# EAGLE design MYC_Homematic (EAGLE 7.3.0)
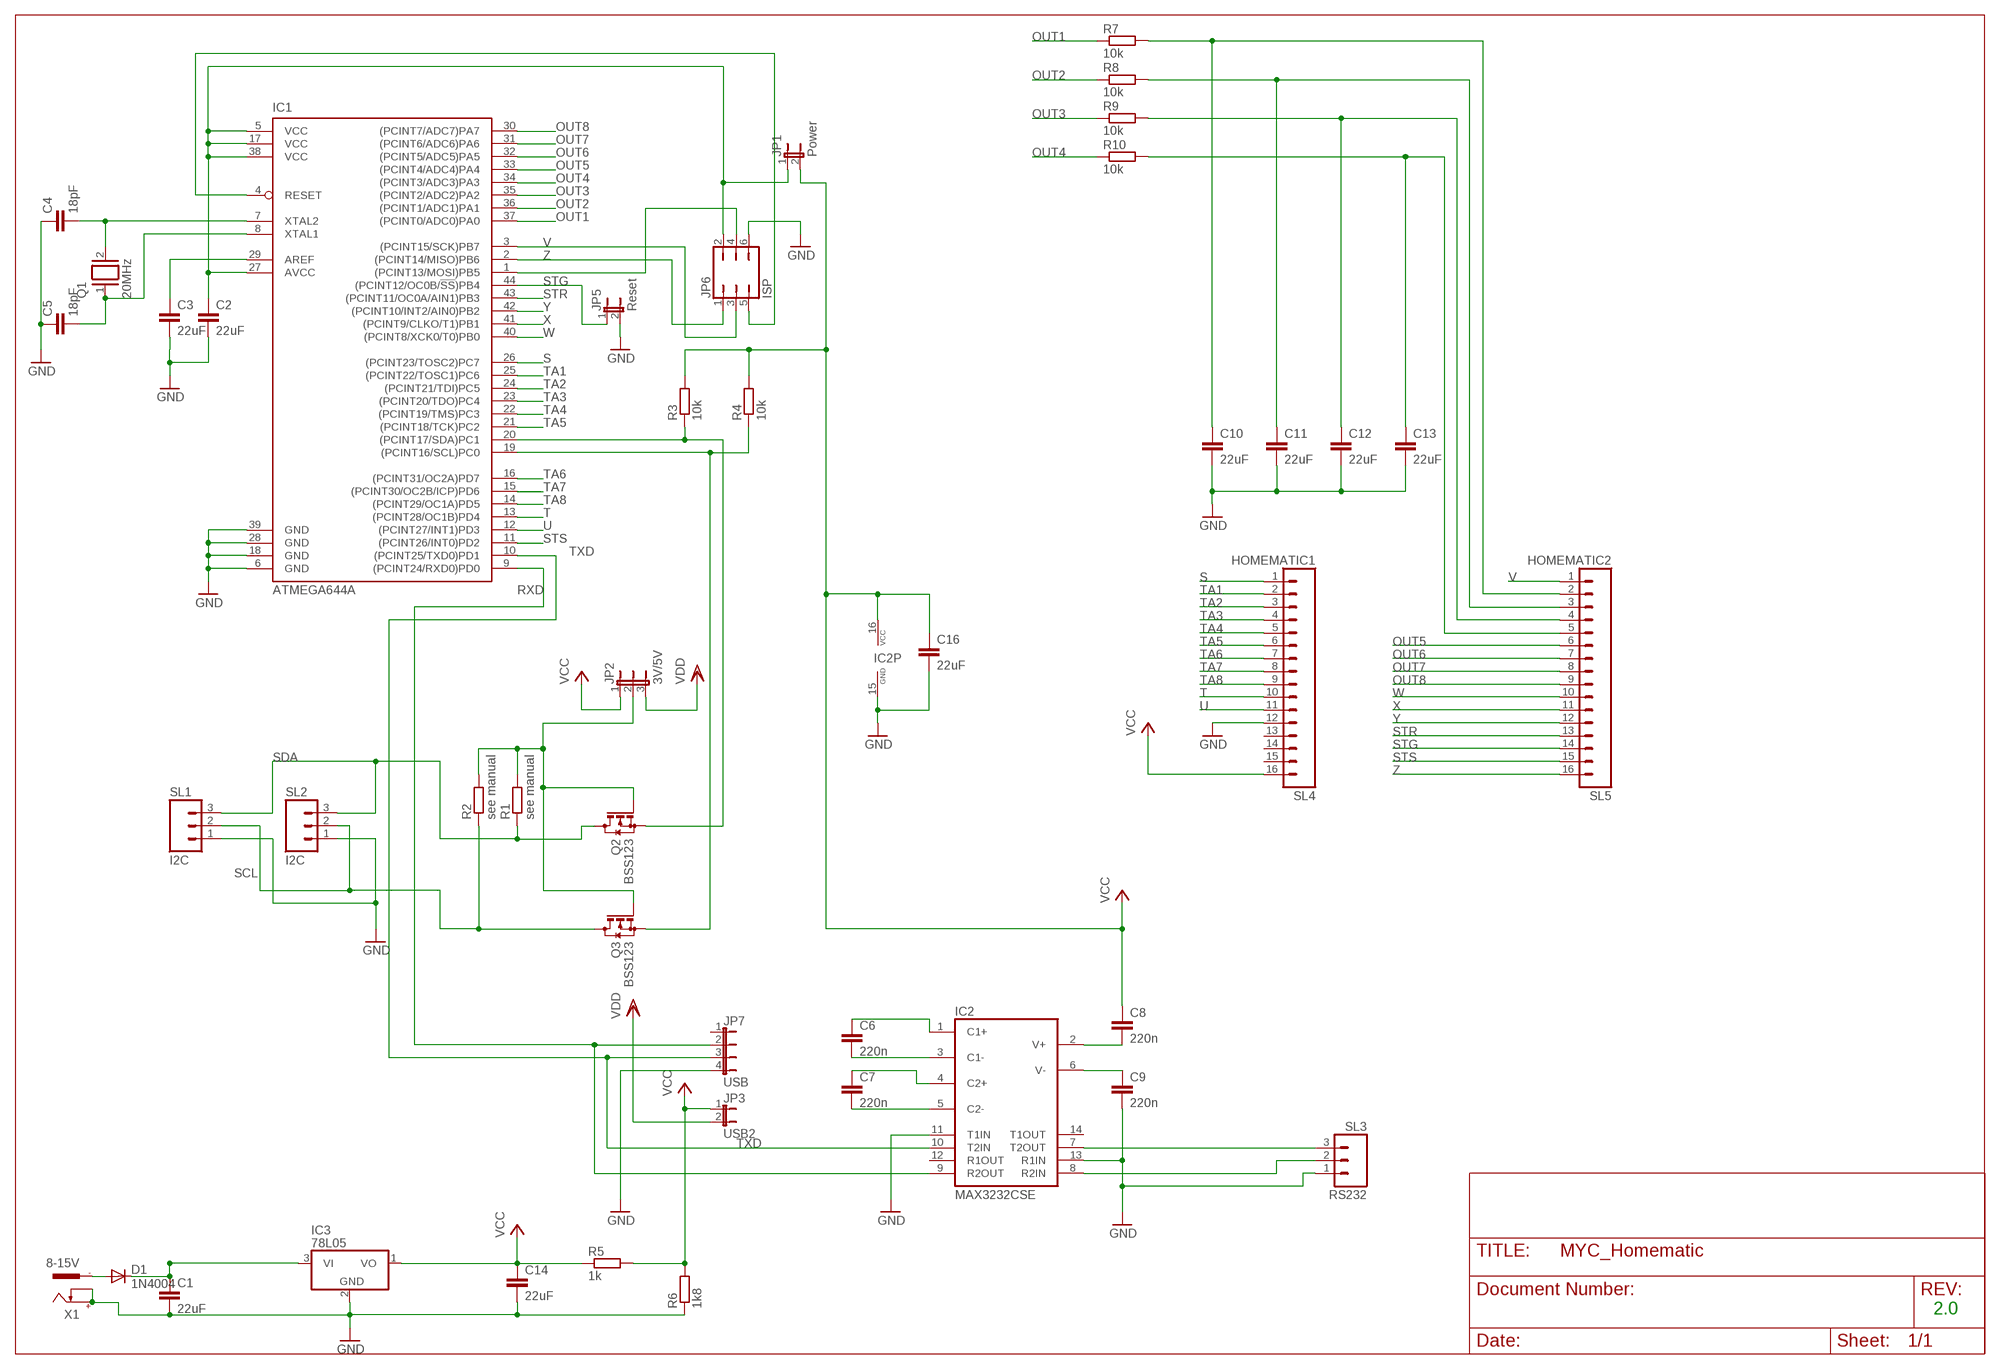
[diagram p0: schematic, sheet 1]

## Parts
C1  22uF  C-EUC1206  [C1206]
C2  22uF  C-EUC1206  [C1206]
C3  22uF  C-EUC1206  [C1206]
C4  18pF  C-EU025-030X050  [C025-030X050]
C5  18pF  C-EU025-030X050  [C025-030X050]
C6  220n  C-EUC1206  [C1206]
C7  220n  C-EUC1206  [C1206]
C8  220n  C-EUC1206  [C1206]
C9  220n  C-EUC1206  [C1206]
C10  22uF  C-EUC1206  [C1206]
C11  22uF  C-EUC1206  [C1206]
C12  22uF  C-EUC1206  [C1206]
C13  22uF  C-EUC1206  [C1206]
C14  22uF  C-EUC1206  [C1206]
C16  22uF  C-EUC1206  [C1206]
D1  1N4004  [DO41-10]
IC1  ATMEGA644A  [TQFP44]
IC2  MAX3232CSE  [SO16]
IC3  78L05  7805L  [TO92]
JP1  Power  JP1E  [JP1]
JP2  3V/5V  JP2E  [JP2]
JP3  USB2  JP1E  [JP1]
JP5  Reset  JP1E  [JP1]
JP6  ISP  JP3Q  [JP3Q]
JP7  USB  JP4E  [JP4]
Q1  20MHz  XTAL/S  [QS]
Q2  BSS123  [SOT23]
Q3  BSS123  [SOT23]
R1  see manual  R-EU_R1206  [R1206]
R2  see manual  R-EU_R1206  [R1206]
R3  10k  R-EU_R1206  [R1206]
R4  10k  R-EU_R1206  [R1206]
R5  1k  R-EU_R1206  [R1206]
R6  1k8  R-EU_R1206  [R1206]
R7  10k  R-EU_R1206  [R1206]
R8  10k  R-EU_R1206  [R1206]
R9  10k  R-EU_R1206  [R1206]
R10  10k  R-EU_R1206  [R1206]
SL1  I2C  M03  [03P]
SL2  I2C  M03  [03P]
SL3  RS232  M03  [03P]
SL4  HOMEMATIC1  M16  [16P]
SL5  HOMEMATIC2  M16  [16P]
X1  8-15V  737992-55  [737992-5]

## Nets
C13: C6.1 IC2.1(C1+)
GND: C1.2 C2.2 C3.2 C4.1 C5.1 C9.2 C10.2 C11.2 C12.2 C13.2 C14.2 C16.2 IC1.6(GND) IC1.18(GND) IC1.28(GND) IC1.39(GND) IC2.11(T1IN) IC2.13(R1IN) IC2.15(GND) IC3.2(GND) JP5.2 JP6.6 JP7.4 R6.1 SL1.1 SL2.1 SL3.1 SL4.12 X1.+ X1.K
N$1: C1.1 D1.C IC3.3(VI)
N$3: C7.2 IC2.5(C2-)
N$4: JP2.2 Q2.1(G) Q3.1(G) R1.2 R2.2
N$5: IC1.19((PCINT16/SCL)PC0) Q3.2(S) R4.1
N$6: C3.1 IC1.29(AREF)
N$7: C2.1 IC1.5(VCC) IC1.17(VCC) IC1.27(AVCC) IC1.38(VCC) JP1.1 JP6.2
N$8: IC1.20((PCINT17/SDA)PC1) Q2.2(S) R3.1
N$10: D1.A X1.-1
N$11: IC2.8(R2IN) SL3.2
N$12: IC1.1((PCINT13/MOSI)PB5) JP6.4
N$13: C7.1 IC2.4(C2+)
N$14: C6.2 IC2.3(C1-)
N$15: C10.1 R7.2 SL5.2
N$16: C8.2 IC2.2(V+)
N$17: C9.1 IC2.6(V-)
N$19: C4.2 IC1.7(XTAL2) Q1.2
N$20: C11.1 R8.2 SL5.3
N$21: C12.1 R9.2 SL5.4
N$22: C13.1 R10.2 SL5.5
N$24: IC1.4(RESET) JP6.5
N$27: IC2.7(T2OUT) SL3.3
N$37: C5.2 IC1.8(XTAL1) Q1.1
OUT1: IC1.37((PCINT0/ADC0)PA0) R7.1
OUT2: IC1.36((PCINT1/ADC1)PA1) R8.1
OUT3: IC1.35((PCINT2/ADC2)PA2) R9.1
OUT4: IC1.34((PCINT3/ADC3)PA3) R10.1
OUT5: IC1.33((PCINT4/ADC4)PA4) SL5.6
OUT6: IC1.32((PCINT5/ADC5)PA5) SL5.7
OUT7: IC1.31((PCINT6/ADC6)PA6) SL5.8
OUT8: IC1.30((PCINT7/ADC7)PA7) SL5.9
RXD: IC1.9((PCINT24/RXD0)PD0) IC2.9(R2OUT) JP7.2
S: IC1.26((PCINT23/TOSC2)PC7) SL4.1
SCL: Q3.3(D) R2.1 SL1.2 SL2.2
SDA: Q2.3(D) R1.1 SL1.3 SL2.3
STG: IC1.44((PCINT12/OC0B/!SS!)PB4) JP5.1 SL5.14
STR: IC1.43((PCINT11/OC0A/AIN1)PB3) SL5.13
STS: IC1.11((PCINT26/INT0)PD2) SL5.15
T: IC1.13((PCINT28/OC1B)PD4) SL4.10
TA1: IC1.25((PCINT22/TOSC1)PC6) SL4.2
TA2: IC1.24((PCINT21/TDI)PC5) SL4.3
TA3: IC1.23((PCINT20/TDO)PC4) SL4.4
TA4: IC1.22((PCINT19/TMS)PC3) SL4.5
TA5: IC1.21((PCINT18/TCK)PC2) SL4.6
TA6: IC1.16((PCINT31/OC2A)PD7) SL4.7
TA7: IC1.15((PCINT30/OC2B/ICP)PD6) SL4.8
TA8: IC1.14((PCINT29/OC1A)PD5) SL4.9
TXD: IC1.10((PCINT25/TXD0)PD1) IC2.10(T2IN) JP7.3
U: IC1.12((PCINT27/INT1)PD3) SL4.11
V: IC1.3((PCINT15/SCK)PB7) JP6.3 SL5.1
VCC: C8.1 C14.1 C16.1 IC2.16(VCC) IC3.1(VO) JP1.2 JP2.1 JP3.1 R3.2 R4.2 R5.1 R5.2 R6.2 SL4.16
VDD: JP2.3 JP3.2
W: IC1.40((PCINT8/XCK0/T0)PB0) SL5.10
X: IC1.41((PCINT9/CLKO/T1)PB1) SL5.11
Y: IC1.42((PCINT10/INT2/AIN0)PB2) SL5.12
Z: IC1.2((PCINT14/MISO)PB6) JP6.1 SL5.16
Unconnected: IC2.12(R1OUT) IC2.14(T1OUT) JP7.1 SL4.13 SL4.14 SL4.15 X1.-2

## Notes on the sheet
- 2.0

## Library data of the parts
C1-C14 C16 = resistor:C-EU: CAPACITOR, European symbol
D1 = diode:1N4004: DIODE general purpose rectifier, 1 A
IC1 = atmel:ATMEGA644: 8-bit Microcontroller with 64K Bytes In-System Programmable Flash Source: http://www.atmel.com/dyn/resources/prod_documents/doc2593.pdf; MPN: ATMEGA644PV-10AU; OC_FARNELL: 1455123; OC_NEWARK: 58M3748
IC2 = maxim:MAX3232*: True RS-232 Transceivers 3.0V to 5.5V, Low-Power up to 1Mbps, Using Four 0.1µF External Capacitors Source: http://pdfserv.maxim-ic.com/en/ds/MAX3222-MAX3241.pdf; MPN: MAX3232CSE; OC_FARNELL: 9725490; OC_NEWARK: 90C2890
IC3 = linear:78*: Positive VOLTAGE REGULATOR Source: http://cache.national.com/ds/LM/LM78L05.pdf http://www.fairchildsemi.com/ds/LM/LM7805.pdf
JP1 JP3 JP5 = jumper:JP1E: JUMPER
JP2 = jumper:JP2E: JUMPER
JP6 = jumper:JP3Q: JUMPER
JP7 = jumper:JP4E: JUMPER
Q1 = special:XTAL/S: CRYSTAL
Q2 Q3 = transistor-small-signal:BSS123: N-CHANNEL MOS FET
R1-R10 = resistor:R-EU_: RESISTOR, European symbol
SL1-SL3 = con-amp-quick:M03: AMP QUICK CONNECTOR; OC_FARNELL: unknown; OC_NEWARK: unknown
SL4 SL5 = con-amp-quick:M16: AMP QUICK CONNECTOR; OC_FARNELL: unknown; OC_NEWARK: unknown
X1 = con-conrad:737992-55: FEMALE PRINT CONNECTOR DIN 45323 (34V/3A), ROKA, distributor Conrad

## Board
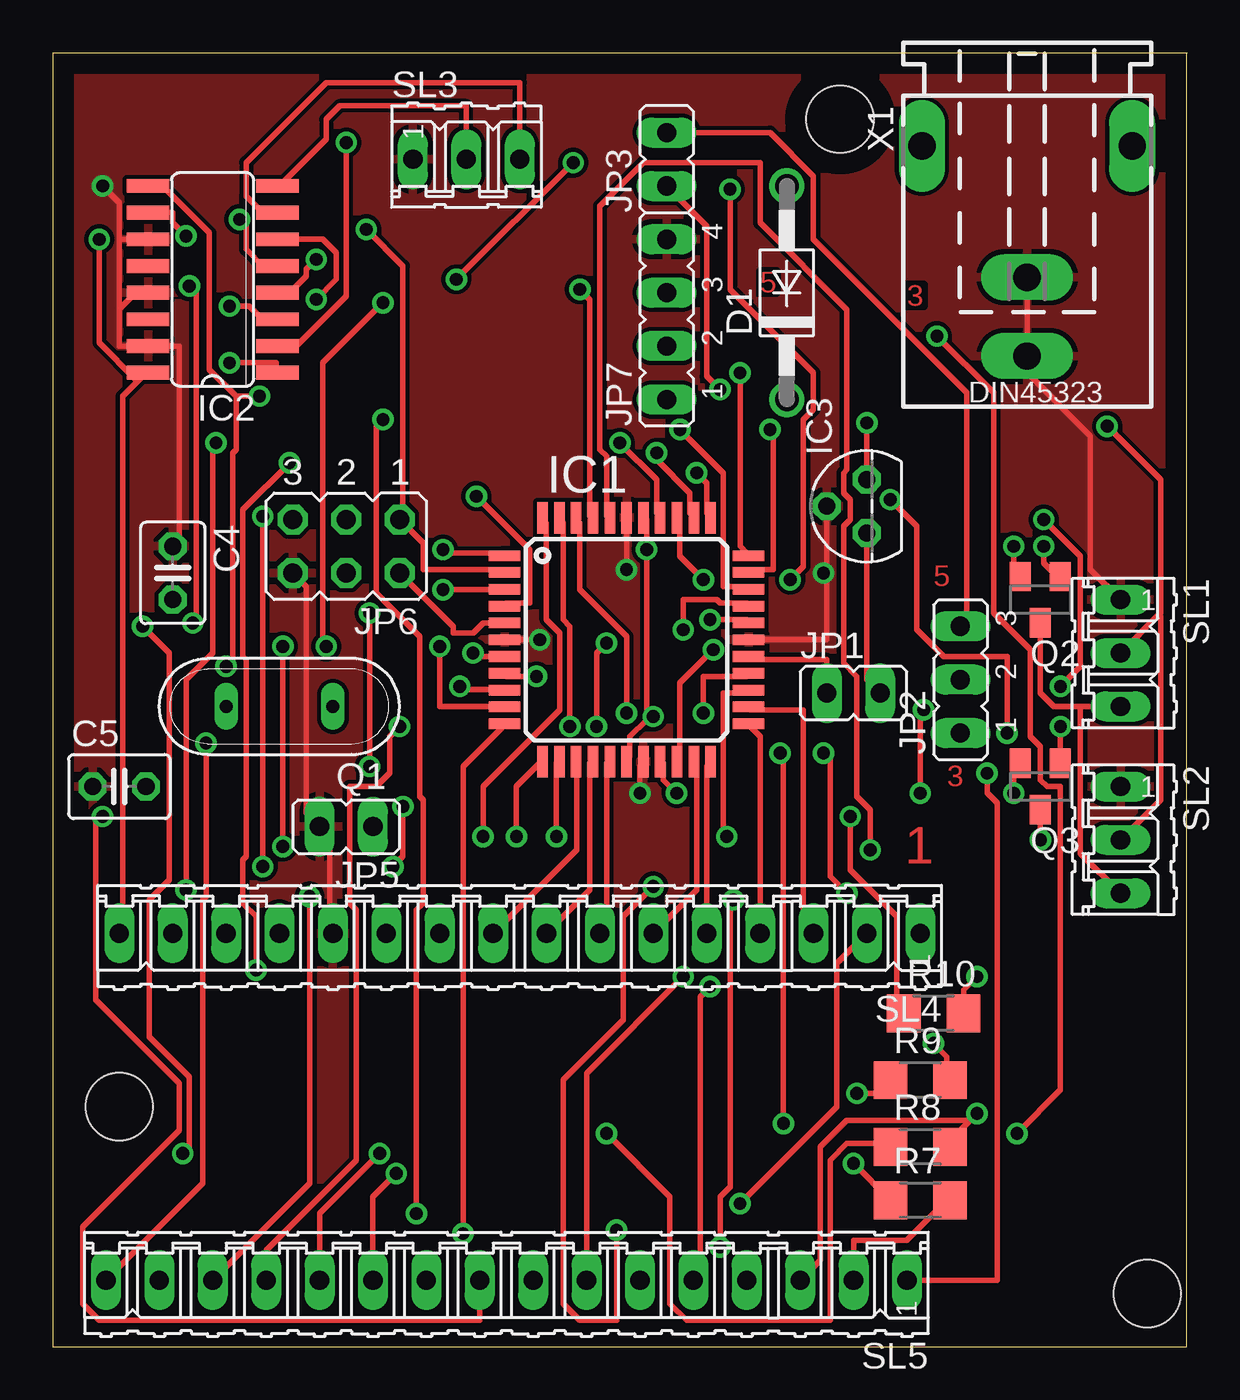
[diagram p1: board, top side]
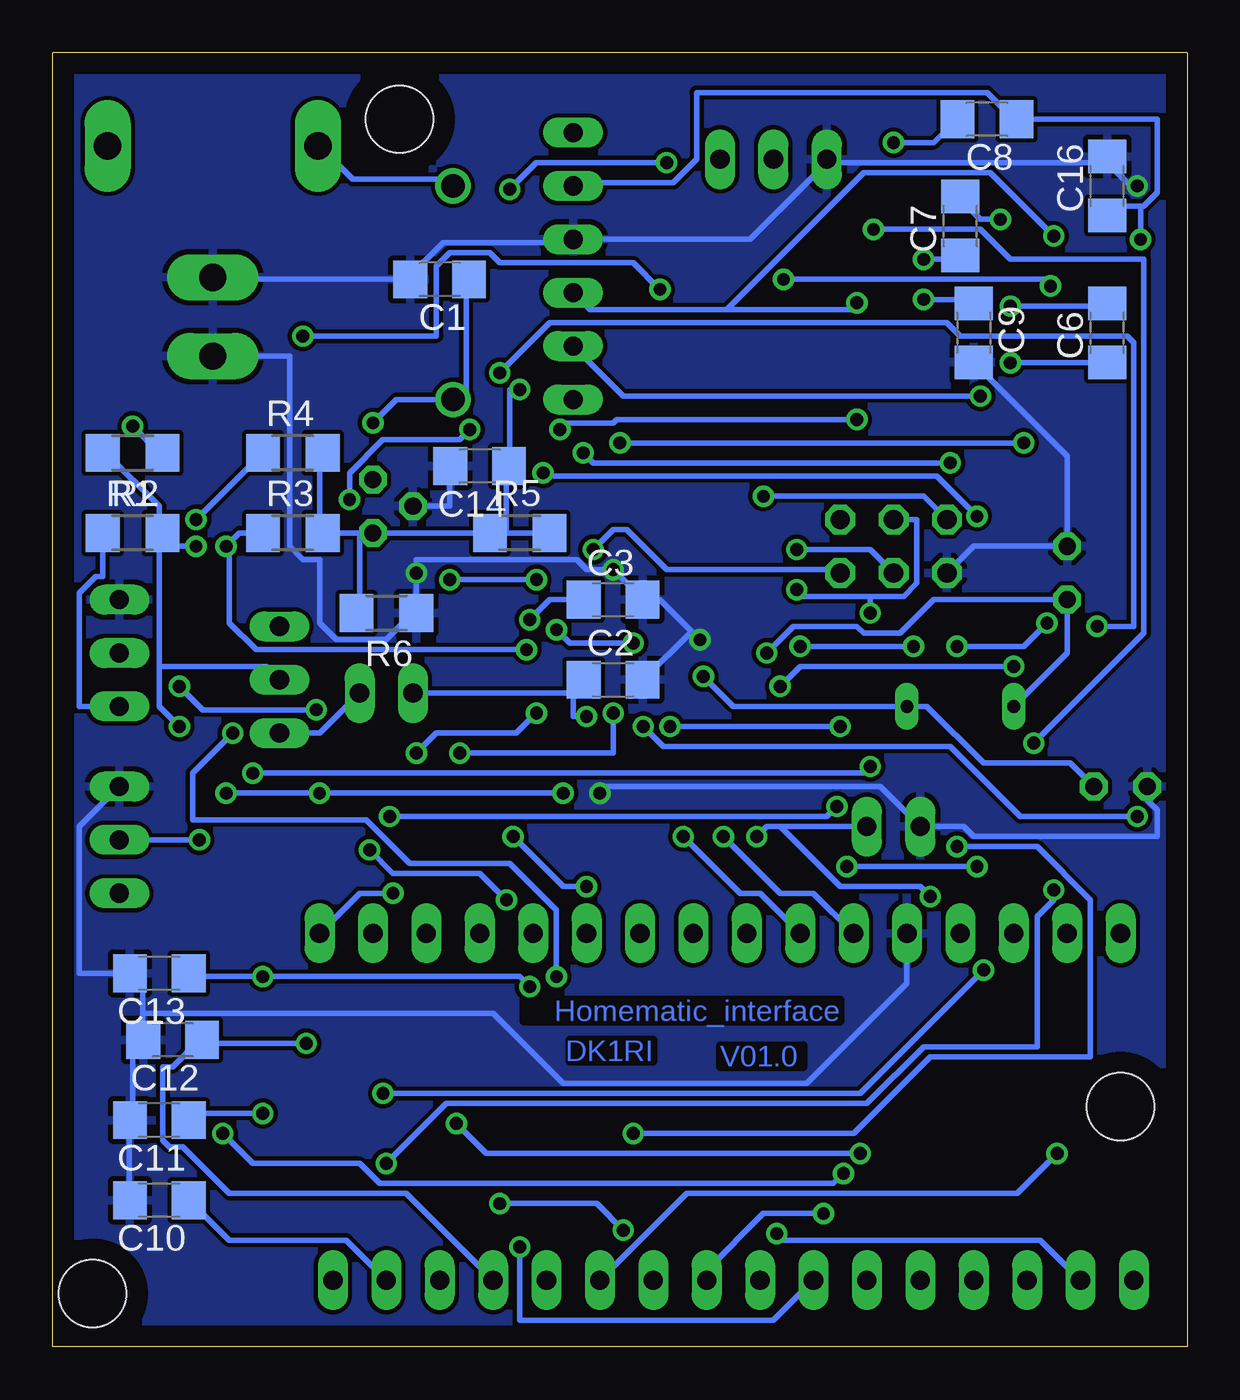
[diagram p2: board, bottom side, seen from below]

Size 53.98 x 61.59 mm. Coordinates in mm from the lower left corner, seen from the top.
Outline: 53.95,61.58 53.95,0 0,0 0,61.59 53.98,61.59
Copper layers (1*16): Top 0.035mm / dielectric 1.5mm / Bottom 0.035mm
Design rules "default": minimum track width 10mil, minimum drill 24mil, track to track 8mil, track to pad 8mil, pad to pad 8mil, via to via 8mil, smd to smd 8mil, copper to edge 40mil, drill to drill 8mil, minimum pad ring 10mil, minimum via ring 8mil, stop-mask expansion 4mil, vias tented up to drill 0mil, thermal gap 10mil
Holes 3.2 mm at 37.47,58.42 52.07,2.54 3.17,11.43

### Footprints (pad centres in the part's own frame; a part is rotated, then mirrored left to right if it is on the bottom)
C1206 = smd 1.6 x 1.8: 1 -1.4,0; 2 1.4,0
C025-030X050 = drill 0.813 octagon: 1 -1.27,0; 2 1.27,0
DO41-10 = drill 1.118: A 5.08,0; C -5.08,0
TQFP44 = smd 1.5 x 0.5: 1 -5.8,4; 2 -5.8,3.2; 3 -5.8,2.4; 4 -5.8,1.6; 5 -5.8,0.8; 6 -5.8,0; 7 -5.8,-0.8; 8 -5.8,-1.6; 9 -5.8,-2.4; 10 -5.8,-3.2; 11 -5.8,-4; 23 5.8,-4; 24 5.8,-3.2; 25 5.8,-2.4; 26 5.8,-1.6; 27 5.8,-0.8; 28 5.8,0; 29 5.8,0.8; 30 5.8,1.6; 31 5.8,2.4; 32 5.8,3.2; 33 5.8,4 | smd 0.5 x 1.5: 12 -4,-5.8; 13 -3.2,-5.8; 14 -2.4,-5.8; 15 -1.6,-5.8; 16 -0.8,-5.8; 17 0,-5.8; 18 0.8,-5.8; 19 1.6,-5.8; 20 2.4,-5.8; 21 3.2,-5.8; 22 4,-5.8; 34 4,5.8; 35 3.2,5.8; 36 2.4,5.8; 37 1.6,5.8; 38 0.8,5.8; 39 0,5.8; 40 -0.8,5.8; 41 -1.6,5.8; 42 -2.4,5.8; 43 -3.2,5.8; 44 -4,5.8
SO16 = smd 0.66 x 2.032: 1 -4.445,-3.073; 2 -3.175,-3.073; 3 -1.905,-3.073; 4 -0.635,-3.073; 5 0.635,-3.073; 6 1.905,-3.073; 7 3.175,-3.073; 8 4.445,-3.073; 9 4.445,3.073; 10 3.175,3.073; 11 1.905,3.073; 12 0.635,3.073; 13 -0.635,3.073; 14 -1.905,3.073; 15 -3.175,3.073; 16 -4.445,3.073
TO92 = drill 0.813 octagon: 1 -1.27,0; 2 0,1.905; 3 1.27,0
JP1 = drill 0.914 long: 1 0,-1.27; 2 0,1.27
JP2 = drill 0.914 long: 1 -2.54,0; 2 0,0; 3 2.54,0
JP3Q = drill 0.914 octagon: 1 -2.54,-1.27; 2 -2.54,1.27; 3 0,-1.27; 4 0,1.27; 5 2.54,-1.27; 6 2.54,1.27
JP4 = drill 0.914 long: 1 -3.81,0; 2 -1.27,0; 3 1.27,0; 4 3.81,0
QS = drill 0.61 long: 1 -2.54,0; 2 2.54,0
SOT23 = smd 1 x 1.4: 1 -0.95,-1.1; 2 0.95,-1.1; 3 0,1.1
R1206 = smd 1.6 x 1.803: 1 -1.422,0; 2 1.422,0
03P = drill 0.914 long: 1 -2.54,0; 2 0,0; 3 2.54,0
16P = drill 0.914 long: 1 -19.05,0; 2 -16.51,0; 3 -13.97,0; 4 -11.43,0; 5 -8.89,0; 6 -6.35,0; 7 -3.81,0; 8 -1.27,0; 9 1.27,0; 10 3.81,0; 11 6.35,0; 12 8.89,0; 13 11.43,0; 14 13.97,0; 15 16.51,0; 16 19.05,0
737992-5 = drill 1.3 pad 2.184 long: + 0,10; -1 5,0; -2 -5,0; K 0,6.25

### Placement (x,y rotation side)
C1  35.56,50.8 180 bottom
C2  27.3,31.75 0 bottom
C3  27.3,35.56 0 bottom
C4  5.71,36.83 270 top
C5  3.17,26.67 0 top
C6  3.81,48.26 90 bottom
C7  10.79,53.34 90 bottom
C8  9.53,58.42 180 bottom
C9  10.16,48.26 270 bottom
C10  48.9,6.99 180 bottom
C11  48.9,10.79 180 bottom
C12  48.26,14.61 180 bottom
C13  48.9,17.78 180 bottom
C14  33.66,41.91 180 bottom
C16  3.81,55.24 90 bottom
D1  34.92,50.16 90 top
IC1  27.3,33.66 0 top
IC2  7.62,50.8 90 top
IC3  38.73,40.01 90 top
JP1  38.1,31.11 270 top
JP2  43.18,31.75 90 top
JP3  29.21,56.52 0 top
JP5  13.97,24.77 90 top
JP6  13.97,38.1 180 top
JP7  29.21,48.9 90 top
Q1  10.79,30.48 180 top
Q2  46.99,35.56 180 top
Q3  46.99,26.67 180 top
R1  50.16,38.73 0 bottom
R2  50.16,42.55 180 bottom
R3  42.55,38.73 0 bottom
R4  42.55,42.55 0 bottom
R5  31.75,38.73 0 bottom
R6  38.1,34.92 180 bottom
R7  41.27,6.99 0 top
R8  41.27,9.53 0 top
R9  41.27,12.7 0 top
R10  41.91,15.88 0 top
SL1  50.8,33.02 270 top
SL2  50.8,24.13 270 top
SL3  19.68,56.52 0 top
SL4  22.23,19.68 180 top
SL5  21.59,3.17 180 top
X1  46.35,57.15 180 top

### Tracks (layer width: path | path; a pad name or v marks a point on that pad's centre or on a via)
C13  (via drill 0.61)
  Top 0.254: v8.41,46.83 10.64,46.83 10.64,46.35 IC2.1
  Bottom 0.254: v8.41,46.83 3.81,46.83 C6.1
GND  (via drill 0.61)
  Top 0.254: IC1.28 36.83,33.66 36.83,36.83 | IC3.2 36.83,36.83 | v23.18,33.66 IC1.6 | v27.3,36.99 IC1.39 | v36.67,36.83 36.83,36.83 | SL1.1 49.37,36.99 49.37,43.34 46.35,46.35 X1.+ X1.K | 3.25,49.45 3.97,50.16 IC2.13 | 3.25,49.45 3.17,49.37 3.17,47.62 IC2.15 6.03,47.62 6.03,38.42 C4.1 | 3.17,52.7 IC2.11 | 3.17,52.7 3.17,49.53 3.25,49.45 | v27.94,26.35 27.94,27.62 28.1,27.78 IC1.18 | SL4.12 13.18,19.84 13.18,24.29 JP5.2 12.06,25.4 12.06,36.2 JP6.6 | v2.38,55.24 3.17,54.45 3.17,52.7
  Bottom 0.254: IC3.2 35.08,40.01 35.08,41.91 C14.2 | 23.57,34.05 25.08,35.56 25.88,35.56 | 23.57,34.05 v23.18,33.66 | 25.88,35.56 v27.3,36.99 28.57,36.99 29.05,37.47 36.67,37.47 v36.67,36.83 R6.1 36.83,34.92 38.1,33.66 40.48,33.66 41.27,34.45 41.27,37.47 42.07,37.47 42.7,38.1 42.7,47.15 X1.+ | 25.88,35.56 C3.2 | 23.57,34.05 25.88,31.75 C2.2 | 37.15,50.8 46.35,50.8 X1.K | 37.15,50.8 C1.2 36.99,50.8 | 37.15,50.8 35.4,52.55 29.37,52.55 JP7.4 20.8,52.7 17.14,56.36 SL3.1 16.99,56.36 3.97,56.36 3.81,56.52 C16.2 3.81,56.36 2.7,55.24 v2.38,55.24 | C9.2 10.16,46.83 5.71,42.39 C4.1 10.16,38.1 JP6.6 | C10.2 50.32,6.99 50.32,10.79 C11.2 50.16,10.79 50.16,14.61 49.69,14.61 | 49.69,15.88 49.69,17.78 C13.2 52.7,17.78 52.7,24.77 SL2.1 | 49.69,15.88 49.69,14.61 | 49.69,14.61 C12.2 | v27.94,26.35 27.62,26.67 14.61,26.67 JP5.2 10.64,24.77 10.16,24.29 1.43,24.29 1.43,25.56 1.91,26.04 C5.1 | 49.69,15.88 33.02,15.88 29.69,12.54 18.1,12.54 13.34,17.3 SL4.12
  pour Top: 0.64,60.96 53.34,60.96 53.34,0.64 0.64,0.64
  pour Bottom: 0.64,60.96 53.34,60.96 53.34,0.64 0.64,0.64
N$1  (via drill 0.61)
  Top 0.254: v38.73,43.97 IC3.3
  Bottom 0.254: C1.1 34.29,50.8 34.29,45.09 D1.C 37.62,45.09 v38.73,43.97
N$3  (via drill 0.61)
  Top 0.254: v8.89,53.66 9.21,53.34 9.21,52.23 10,51.44 IC2.5
  Bottom 0.254: v8.89,53.66 9.84,53.66 10.79,54.61 C7.2
N$4  (via drill 0.61)
  Top 0.254: v47.94,29.53 Q3.1 | v47.15,38.1 47.15,37.31 47.78,36.67 Q2.1
  Bottom 0.254: v47.94,29.53 48.9,30.48 48.9,32.38 | 48.9,38.73 48.9,38.1 | 48.9,38.1 48.9,32.38 | 48.9,38.1 v47.15,38.1 | 48.9,38.1 R1.2 48.9,38.73 | 48.9,38.73 48.9,40.01 51.44,42.55 R2.2 | JP2.2 43.81,32.38 48.9,32.38
N$5  (via drill 0.61)
  Top 0.254: v45.72,26.35 45.72,27.3 46.04,27.62 Q3.2 | v29.69,26.35 29.05,26.99 29.05,27.78 IC1.19 | v47.15,39.37 48.9,37.62 48.9,32.38 v47.94,31.43 | v41.43,30.32 41.27,30.16 v41.27,26.35
  Bottom 0.254: v29.69,26.35 v41.27,26.35 v45.72,26.35 | v47.15,39.37 R4.1 | v47.94,31.43 46.83,30.32 v41.43,30.32
N$6  (via drill 0.61)
  Top 0.254: v31.27,34.61 33.02,34.61 IC1.29
  Bottom 0.254: v31.27,34.61 30.32,35.56 C3.1
N$7  (via drill 0.61)
  Top 0.254: JP1.1 36.83,32.7 33.18,32.7 IC1.27 | JP6.2 19.05,34.29 19.05,33.97 20,33.97 20.48,34.45 21.43,34.45 IC1.5 | 28.26,30 v28.26,37.94 28.26,39.37 IC1.38 | 28.26,30 28.26,29.84 27.46,29.05 27.46,28.1 27.3,27.94 IC1.17 | 28.26,30 v28.57,30
  Bottom 0.254: JP1.1 29.37,31.11 28.73,31.75 C2.1 29.21,31.11 29.21,30 v28.57,30 | JP6.2 16.67,36.99 24.77,36.99 26.67,38.89 27.3,38.89 v28.26,37.94
N$8  (via drill 0.61)
  Top 0.254: v45.72,38.1 45.72,36.99 Q2.2 | v31.43,33.18 29.84,31.59 29.84,27.94 IC1.20
  Bottom 0.254: R3.1 45.09,38.73 v45.72,38.1 45.56,38.1 45.56,34.45 44.29,33.18 v31.43,33.18
N$10
  Bottom 0.254: D1.A 35.24,55.56 39.69,55.56 41.27,57.15 X1.-1
N$11
  Top 0.254: SL3.2 19.68,59.05 13.65,59.05 13.02,58.42 13.02,57.47 10.79,55.24 IC2.8
N$12  (via drill 0.61)
  Top 0.254: v18.57,37.94 18.57,37.78 21.43,37.78 IC1.1
  Bottom 0.254: v18.57,37.94 15.08,37.94 JP6.4
N$13  (via drill 0.61)
  Top 0.254: v12.54,51.75 12.06,51.28 12.06,50.96 11.27,50.16 IC2.4
  Bottom 0.254: v12.54,51.75 10.95,51.75 10.79,51.91 C7.1
N$14  (via drill 0.61)
  Top 0.254: v8.41,49.53 9.37,49.53 10,48.9 IC2.3
  Bottom 0.254: v8.41,49.53 3.81,49.53 C6.2
N$15
  Top 0.254: SL5.2 38.1,5.08 40.64,5.08 42.55,6.99 R7.2
  Bottom 0.254: SL5.2 40.01,5.08 45.56,5.08 47.47,6.99 C10.1
N$16  (via drill 0.61)
  Top 0.254: v13.97,57.31 13.97,50.01 11.59,47.62 IC2.2
  Bottom 0.254: v13.97,57.31 12.06,57.31 10.95,58.42 C8.2
N$17  (via drill 0.61)
  Top 0.254: v12.54,49.85 13.49,50.8 13.49,52.07 12.86,52.7 IC2.6
  Bottom 0.254: v12.54,49.85 10.32,49.85 10.16,49.69 C9.1
N$19  (via drill 0.61)
  Top 0.254: v20,33.02 20,32.86 21.43,32.86 IC1.7
  Bottom 0.254: v20,33.02 18.73,34.29 15.72,34.29 15.4,33.97 13.65,33.97 12.06,35.56 C4.2 5.71,33.02 Q1.2
N$20  (via drill 0.61)
  Top 0.254: 43.58,10.72 42.7,9.84 R8.2 | 43.58,10.72 v43.97,11.11 | SL5.3 36.51,4.13 36.51,9.53 37.78,10.79 43.5,10.79 43.58,10.72
  Bottom 0.254: v43.97,11.11 47.15,11.11 47.47,10.79 C11.1
N$21  (via drill 0.61)
  Top 0.254: v41.91,14.45 42.55,13.81 42.55,12.7 R9.2
  Bottom 0.254: v41.91,14.45 46.67,14.45 46.83,14.61 C12.1 46.99,14.61 48.26,13.34 48.74,13.34 48.74,9.84 48.42,9.53 47.78,9.53 45.56,7.3 37.15,7.3 SL5.4
N$22  (via drill 0.61)
  Top 0.254: v43.97,17.62 43.34,16.99 R10.2 | SL5.5 30.8,3.49 30.8,16.67 v31.27,17.14
  Bottom 0.254: C13.1 47.47,17.78 47.31,17.62 v43.97,17.62 31.75,17.62 v31.27,17.14
N$24  (via drill 0.61)
  Top 0.254: v20.16,40.48 22.7,37.94 22.7,35.4 21.59,35.4 IC1.4
  Bottom 0.254: v20.16,40.48 12.54,40.48 JP6.5
N$27
  Top 0.254: IC2.7 9.84,53.98 9.84,54.13 9.21,54.77 9.21,56.36 13.02,60.17 22.23,60.17 SL3.3
N$37  (via drill 0.61)
  Top 0.254: v23.02,31.91 21.59,31.91 IC1.8
  Bottom 0.254: v23.02,31.91 21.59,30.48 Q1.1 12.38,30.48 9.68,27.78 5.56,27.78 C5.2
OUT1  (via drill 0.61)
  Top 0.254: v26.99,43.02 28.73,41.27 28.73,39.69 28.89,39.53 IC1.37 | v7.78,43.02 7.62,42.86 7.62,33.02 6.35,31.75 v6.35,21.75 | v38.1,8.73 R7.1
  Bottom 0.254: v7.78,43.02 v26.99,43.02 | v6.35,21.75 6.35,21.27 7.14,20.48 7.14,14.29 12.54,14.29 15.24,11.59 35.24,11.59 v38.1,8.73
OUT2  (via drill 0.61)
  Top 0.254: v30.96,36.51 29.84,37.62 29.84,39.37 IC1.36 | v35.08,36.51 35.72,37.15 35.72,44.13 36.2,44.61 36.2,46.35 32.23,50.32 v32.23,55.09 | v19.21,50.8 v24.77,56.36 | v6.51,50.48 6.83,50.16 6.83,34.61 v6.67,34.45 | v10.95,23.81 v10.95,33.34 | v26.35,10.16 29.37,7.14 29.37,2.06 30.16,1.27 36.99,1.27 36.99,8.89 37.78,9.68 39.85,9.68 R8.1
  Bottom 0.254: v35.08,36.51 v30.96,36.51 | v32.23,55.09 30.96,56.36 v24.77,56.36 | v19.21,50.8 6.83,50.8 v6.51,50.48 | v6.67,34.45 7.78,33.34 v10.95,33.34 | v10.95,23.81 7.14,23.81 4.6,21.27 4.6,13.81 12.22,13.81 15.88,10.16 v26.35,10.16
OUT3  (via drill 0.61)
  Top 0.254: v28.73,42.55 28.73,42.23 30.32,40.64 30.32,39.69 30.48,39.53 IC1.35 | v11.27,42.07 9.05,39.85 9.05,32.86 9.21,32.7 9.21,23.34 9.05,23.18 9.05,21.11 9.68,20.48 v9.68,17.94 | v38.26,12.06 39.85,12.06 R9.1
  Bottom 0.254: v28.73,42.55 28.26,42.07 v11.27,42.07 | v9.68,17.94 15.56,12.06 v38.26,12.06
OUT4  (via drill 0.61)
  Top 0.254: v30.64,41.59 31.11,41.12 31.11,39.69 31.27,39.53 IC1.34 | v10,22.86 v10,39.53 | v16.19,22.86 16.67,23.34 v16.67,25.72 | v37.94,25.24 37.94,22.7 40.16,20.48 40.16,16.19 R10.1
  Bottom 0.254: v30.64,41.59 30.48,41.43 11.91,41.43 v10,39.53 | v16.19,22.86 v10,22.86 | v16.67,25.72 17.14,25.24 v37.94,25.24
OUT5  (via drill 0.61)
  Top 0.254: v32.7,46.35 32.7,38.1 33.02,37.78 IC1.33 | v4.29,34.29 5.56,33.02 5.56,22.23 4.6,21.27 4.6,14.76 6.51,12.86 6.51,9.53 v6.19,9.21
  Bottom 0.254: v32.7,46.35 30.32,48.74 11.43,48.74 10.79,48.1 2.86,48.1 2.54,47.78 2.54,34.29 v4.29,34.29 | v6.19,9.21 8.1,7.3 23.81,7.3 SL5.6
OUT6  (via drill 0.61)
  Top 0.254: v34.13,43.66 34.29,43.5 34.29,36.99 33.18,36.99 IC1.32 | v39.85,40.32 41.12,39.05 41.12,34.13 42.39,32.86 45.4,32.86 v45.4,29.21 | v30,17.62 25.4,13.02 SL5.7
  Bottom 0.254: v34.13,43.66 34.61,43.18 38.26,43.18 39.85,41.59 v39.85,40.32 | v45.4,29.21 47.31,27.3 47.31,25.08 39.05,25.08 36.99,23.02 32.23,23.02 30,20.8 v30,17.62
OUT7  (via drill 0.61)
  Top 0.254: v29.84,43.66 31.91,41.59 31.91,36.2 33.02,36.2 IC1.31 | v15.72,44.13 15.4,43.81 15.4,35.88 17.46,33.81 17.46,26.19 17.62,26.04 17.62,21.11 17.3,20.8 v17.3,6.35
  Bottom 0.254: v29.84,43.66 29.53,43.97 27.3,43.97 27.15,44.13 v15.72,44.13 | v17.3,6.35 20.16,6.35 22.86,3.65 SL5.8
OUT8  (via drill 0.61)
  Top 0.254: v30,34.13 30,35.56 31.59,35.56 31.75,35.4 33.02,35.4 IC1.30 | v26.35,33.5 25.88,33.02 v25.88,29.53 | v2.38,25.24 2.06,24.92 2.06,16.51 6.03,12.54 6.03,10.32 1.43,5.71 1.43,2.06 2.22,1.27 20.32,1.27 SL5.9
  Bottom 0.254: v30,34.13 29.37,33.5 v26.35,33.5 | v25.88,29.53 24.92,28.57 11.27,28.57 7.94,25.24 v2.38,25.24
RXD  (via drill 0.61)
  Top 0.254: v19.37,31.43 19.37,31.27 21.43,31.27 IC1.9 | v8.26,32.38 8.57,32.7 8.57,42.55 8.73,42.7 8.73,45.24 | 8.73,45.24 7.46,46.51 7.46,53.02 5.24,55.24 IC2.9 | 8.73,45.24 v9.84,45.24
  Bottom 0.254: v19.37,31.43 18.41,32.38 v8.26,32.38 | JP7.2 26.83,45.24 v9.84,45.24
S  (via drill 0.61)
  Top 0.254: v30.96,30.16 30.96,31.91 33.02,31.91 IC1.26 | v36.67,28.26 36.99,27.94 36.99,22.38 v37.78,21.59
  Bottom 0.254: v30.96,30.16 31.91,29.21 35.72,29.21 v36.67,28.26 | v37.78,21.59 39.37,21.59 SL4.1
SCL  (via drill 0.61)
  Top 0.254: v46.99,24.13 Q3.3 | v50.16,43.81 52.7,41.27 52.7,34.92 52.63,34.85 | SL1.2 52.63,34.85 | SL2.2 52.7,26.04 52.7,34.77 52.63,34.85
  Bottom 0.254: SL2.2 v46.99,24.13 | v50.16,43.81 48.9,42.55 R2.1
SDA
  Top 0.254: Q2.3 46.99,31.11 47.62,30.48 48.9,30.48 | SL1.3 48.9,30.48 | SL2.3 48.9,23.5 48.9,30.48
  Bottom 0.254: SL1.3 52.7,30.48 52.7,35.88 51.91,36.67 51.59,36.67 R1.1
STG  (via drill 0.61)
  Top 0.254: v20.48,24.29 20.48,26.67 24.13,30.32 24.13,33.97 23.5,34.61 23.5,39.21 23.34,39.37 IC1.44 | SL5.14 12.22,7.78 v12.22,21.43
  Bottom 0.254: v20.48,24.29 20,24.77 19.37,24.77 | JP5.1 19.37,24.77 | v12.22,21.43 12.7,21.91 16.51,21.91 19.37,24.77
STR  (via drill 0.61)
  Top 0.254: v24.61,29.53 24.61,34.29 24.29,34.61 24.29,39.21 24.13,39.37 IC1.43 | v16.51,29.53 16.03,29.05 16.03,27.3 15.4,26.67 14.13,26.67 14.13,21.11 14.45,20.8 14.45,8.89 10.16,4.6 SL5.13
  Bottom 0.254: v16.51,29.53 v24.61,29.53
STS  (via drill 0.61)
  Top 0.254: v19.53,5.4 19.53,27.62 21.43,29.53 IC1.11
  Bottom 0.254: v19.53,5.4 19.21,5.08 6.99,5.08 SL5.15
T  (via drill 0.61)
  Top 0.254: v23.97,24.29 23.97,27.78 IC1.13
  Bottom 0.254: v23.97,24.29 21.27,21.59 20.32,21.59 SL4.10
TA1  (via drill 0.61)
  Top 0.254: v32.07,24.29 31.91,24.45 31.91,31.11 33.02,31.11 IC1.25 | v28.57,21.91 27.15,20.48 27.15,15.56 24.29,12.7 24.29,2.06 25.08,1.27 26.83,1.27 v26.83,5.56 | v32.7,6.83 37.31,11.43 37.31,18.26 SL4.2
  Bottom 0.254: v32.07,24.29 29.69,21.91 v28.57,21.91 | v26.83,5.56 28.1,6.83 v32.7,6.83
TA2
  Top 0.254: SL4.3 35.72,20.16 35.72,30.32 33.18,30.32 IC1.24
TA3
  Top 0.254: SL4.4 33.66,29.05 33.18,29.53 IC1.23
TA4
  Top 0.254: SL4.5 31.11,27.62 31.27,27.78 IC1.22
TA5
  Top 0.254: SL4.6 30.64,21.75 30.64,27.78 IC1.21
TA6
  Top 0.254: SL4.7 26.35,20 26.35,27.78 IC1.16
TA7
  Top 0.254: SL4.8 25.56,21.75 25.56,27.78 IC1.15
TA8
  Top 0.254: SL4.9 24.92,23.65 24.92,27.78 IC1.14
TXD  (via drill 0.61)
  Top 0.254: v18.41,33.34 18.41,30.48 21.43,30.48 IC1.10 | v13.02,33.34 12.86,33.5 12.86,46.83 v15.72,49.69 | IC2.10 5.71,53.98 5.71,53.5 v6.35,52.86
  Bottom 0.254: v13.02,33.34 v18.41,33.34 | v15.72,49.69 16.03,49.37 21.91,49.37 | 21.91,49.37 28.42,49.37 JP7.3 | v6.35,52.86 9.37,55.88 15.4,55.88 21.91,49.37
U  (via drill 0.61)
  Top 0.254: v22.07,24.29 22.07,26.67 23.18,27.78 IC1.12
  Bottom 0.254: v22.07,24.29 19.37,21.59 17.78,21.59 SL4.11
V  (via drill 0.61)
  Top 0.254: v18.57,36.04 21.43,36.04 IC1.3 | SL5.1 44.93,3.17 44.93,25.88 44.45,26.35 v44.45,27.3 | v15.08,34.92 v15.08,27.62
  Bottom 0.254: v18.57,36.04 18.26,35.72 15.08,35.72 | 15.08,35.72 13.49,35.72 12.86,36.35 12.86,39.37 JP6.3 | v44.45,27.3 15.4,27.3 v15.08,27.62 | 15.08,35.72 v15.08,34.92
VCC  (via drill 0.61)
  Top 0.254: SL4.16 3.33,19.84 3.33,45.24 4.45,46.35 IC2.16 3.97,46.04 2.22,47.78 v2.22,52.7 | JP1.2 38.73,31.75 IC3.1 | v31.75,45.56 31.11,46.2 31.11,53.34 JP3.1
  Bottom 0.254: JP1.2 41.27,29.21 JP2.1 | 32.38,38.73 32.38,41.91 C14.1 32.23,41.91 32.23,45.56 v31.75,45.56 | 32.38,38.73 R5.1 IC3.1 39.37,38.73 | 32.38,38.73 R5.2 | 39.37,38.73 39.37,34.92 R6.2 | 39.37,38.73 R3.2 41.27,38.73 41.27,42.55 R4.2 | 2.22,54.29 2.06,54.29 1.43,54.93 1.43,58.42 C8.1 8.26,58.42 9.53,59.69 23.34,59.69 23.34,56.52 24.45,55.4 29.05,55.4 JP3.1 | 2.22,54.29 3.49,54.29 3.81,53.98 C16.1 | 2.22,54.29 v2.22,52.7
VDD
  Top 0.254: JP2.3 43.5,34.61 43.5,45.4 36.2,52.7 36.2,55.72 34.13,57.78 JP3.2
W  (via drill 0.61)
  Top 0.254: v38.89,23.65 38.89,25.56 38.26,26.19 38.26,31.91 37.62,32.54 37.62,39.05 37.94,39.37 37.94,40.32 37.62,40.64 37.62,41.59 37.78,41.75 37.78,49.37 33.66,53.5 33.66,56.36 28.1,56.36 26.04,54.29 26.04,42.7 26.35,42.39 26.35,39.53 IC1.40 | v32.38,21.27 32.23,21.11 32.23,7.62 31.75,7.14 v31.75,4.76
  Bottom 0.254: v38.89,23.65 37.78,22.54 33.66,22.54 v32.38,21.27 | v31.75,4.76 31.75,1.27 19.68,1.27 SL5.10
X  (via drill 0.61)
  Top 0.254: v25.08,50.32 25.56,49.85 25.56,39.53 IC1.41 | v42.07,48.1 44.77,45.4 44.77,34.92 46.51,33.18 46.51,29.05 46.99,28.57 46.99,26.99 47.31,26.67 47.94,26.67 47.94,12.22 v45.88,10.16 | v16.35,8.26 15.24,7.14 SL5.11
  Bottom 0.254: v25.08,50.32 26.35,51.59 32.7,51.59 33.18,52.07 35.08,52.07 35.72,51.44 35.72,48.1 v42.07,48.1 | v45.88,10.16 44.45,8.73 39.37,8.73 38.42,7.78 16.83,7.78 v16.35,8.26
Y  (via drill 0.61)
  Top 0.254: v27.3,30.16 27.3,33.81 25.08,36.04 25.08,39.21 24.92,39.37 IC1.42 | v34.61,28.26 34.77,28.1 v34.77,10.64 | v15.56,9.21 12.7,6.35 SL5.12
  Bottom 0.254: v27.3,30.16 27.3,28.26 v34.61,28.26 | v34.77,10.64 33.34,9.21 v15.56,9.21
Z  (via drill 0.61)
  Top 0.254: IC1.2 21.43,36.99 17.62,36.99 17.62,38.26 JP6.1 16.67,39.37 16.67,51.44 v14.92,53.18 | SL5.16 7.14,7.78 7.14,21.27 7.3,21.43 v7.3,28.73
  Bottom 0.254: v7.3,28.73 2.06,33.97 2.06,51.75 8.41,51.75 9.84,53.18 v14.92,53.18

### Text on the board
Top: 5 | 3 | 5 | 3 | 1
Bottom: Homematic_interface | DK1RI | V01.0